# EAGLE design ReelyUsefulPcb-4Blocks (EAGLE 7.4.0)
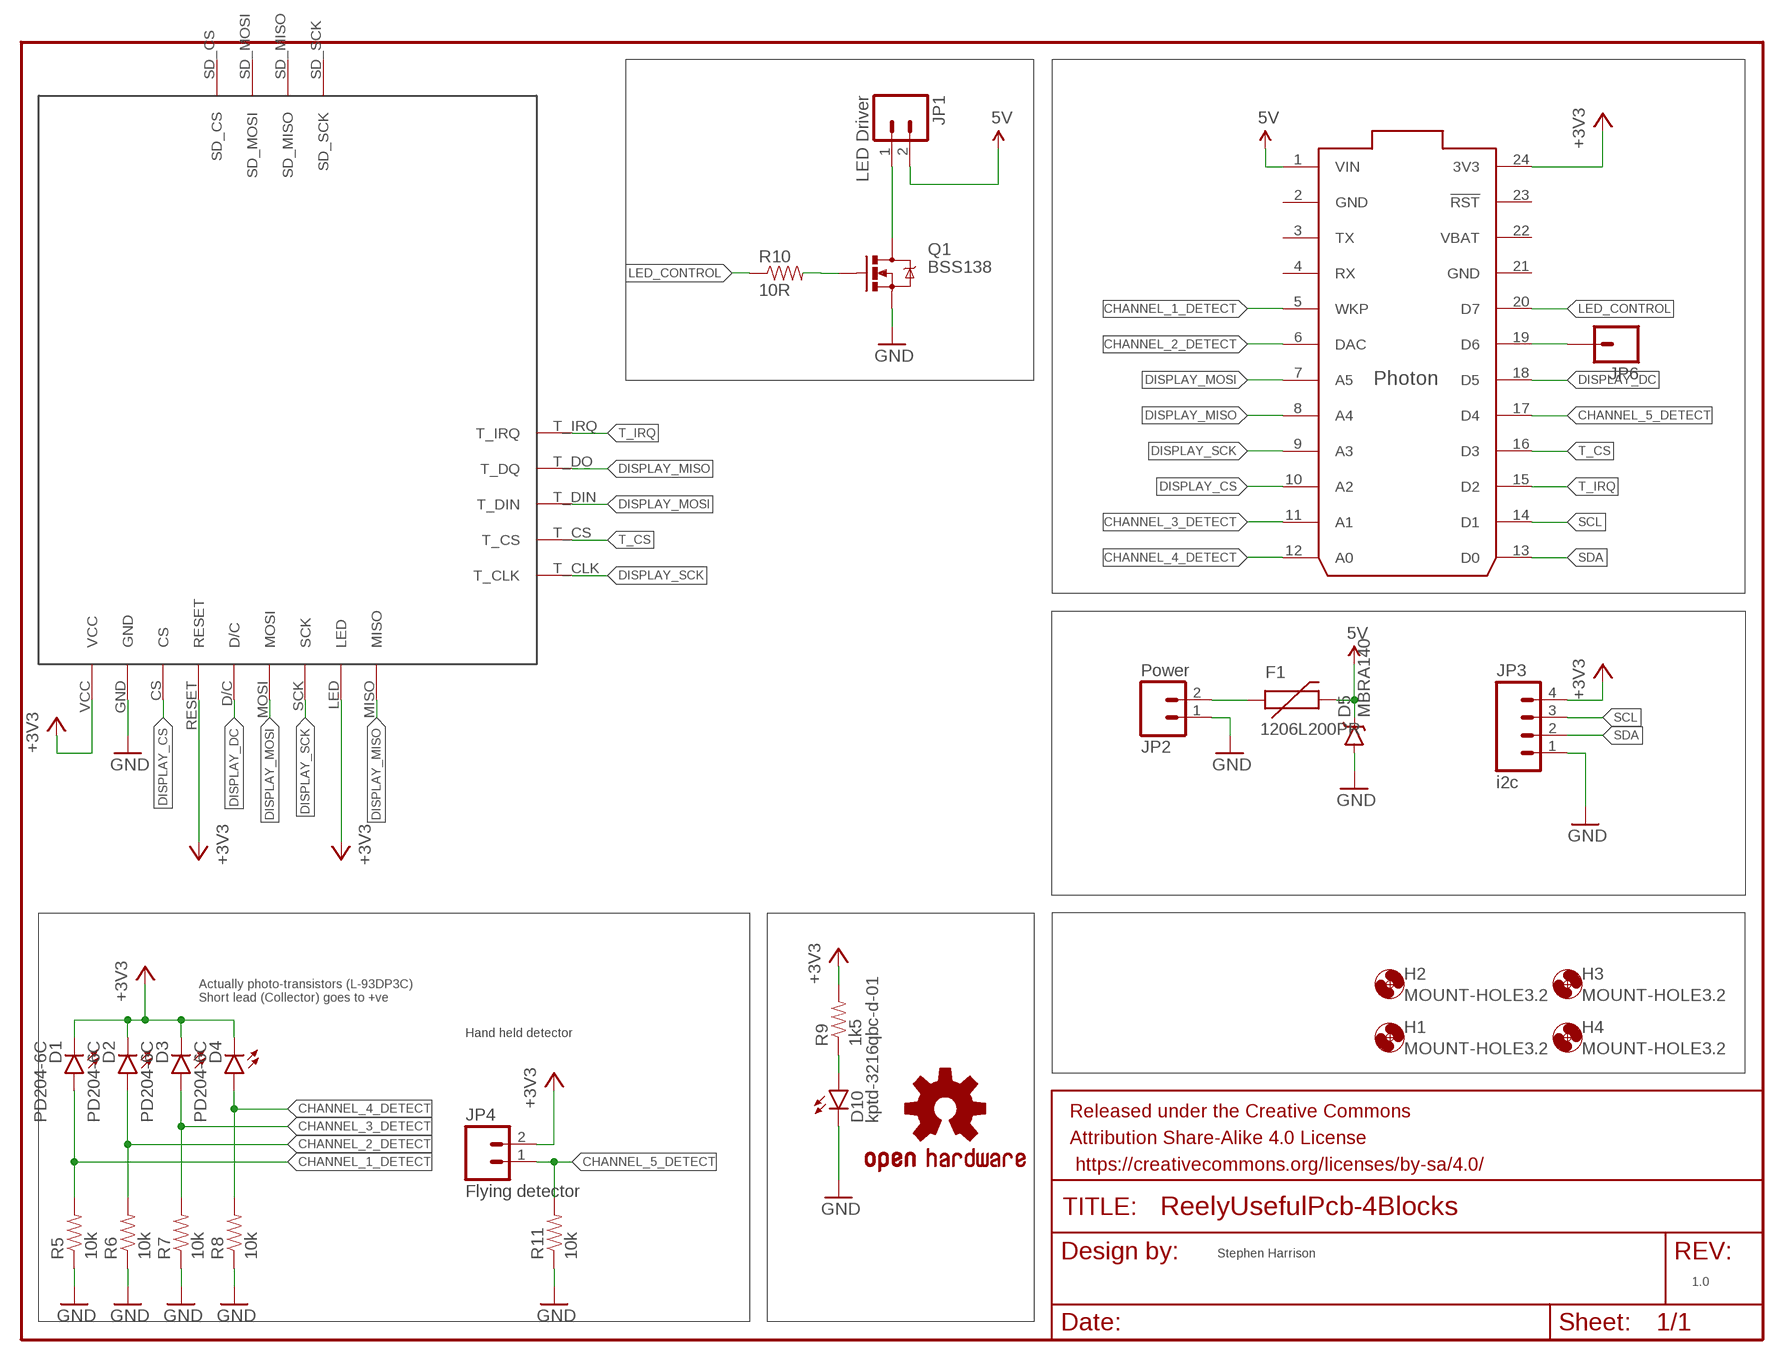
[diagram p0: schematic, sheet 1]

## Parts
D1  PD204-6C  LED3MM  [LED3MM]
D2  PD204-6C  LED3MM  [LED3MM]
D3  PD204-6C  LED3MM  [LED3MM]
D4  PD204-6C  LED3MM  [LED3MM]
D5  MBRA140  [SMA-DIODE]
D10  kptd-3216qbc-d-01  LED1206-BOTTOM  [LED-1206-BOTTOM]
F1  1206L200PR  PTCSMD  [PTC-1206]
FRAME1  FRAME-LETTER  [CREATIVE_COMMONS]
H1  MOUNT-HOLE3.2  [3,2]
H2  MOUNT-HOLE3.2  [3,2]
H3  MOUNT-HOLE3.2  [3,2]
H4  MOUNT-HOLE3.2  [3,2]
JP1  LED Driver  M02JST-PTH-2  [JST-2-PTH]
JP2  Power  M02-JST-2MM-SMT  [JST-2-SMD]
JP3  i2c  M04PTH  [1X04]
JP4  Flying detector  M02JST-PTH-2  [JST-2-PTH]
JP6  M01PTH  [1X01]
LOGO1  OSHW-LOGOL  [OSHW-LOGO-L]
Q1  BSS138  MOSFET-NCHANNELBSS138  [SOT23-3]
R5  10k  RESISTOR1206  [1206]
R6  10k  RESISTOR1206  [1206]
R7  10k  RESISTOR1206  [1206]
R8  10k  RESISTOR1206  [1206]
R9  1k5  RESISTOR1206  [1206]
R10  10R  RESISTOR1206  [1206]
R11  10k  RESISTOR1206  [1206]
U2  TJCTM240  [TJCTM240]
U3  PHOTON_SMD  [PHOTON_SMD]

## Nets
5V: D5.C F1.2 JP1.2 U3.1(VIN)
+3V3: D1.K(C) D2.K(C) D3.K(C) D4.K(C) JP3.4 JP4.2 R9.2 U2.LED U2.RESET U2.VCC U3.24(3V3)
CHANNEL_1_DETECT: D1.A R5.2 U3.5(WKP)
CHANNEL_2_DETECT: D2.A R6.2 U3.6(DAC)
CHANNEL_3_DETECT: D3.A R7.2 U3.11(A1)
CHANNEL_4_DETECT: D4.A R8.2 U3.12(A0)
CHANNEL_5_DETECT: JP4.1 R11.2 U3.17(D4)
DISPLAY_CS: U2.CS U3.10(A2)
DISPLAY_DC: U2.D/C U3.18(D5)
DISPLAY_MISO: U2.MISO U2.T_DO(T_DQ) U3.8(A4)
DISPLAY_MOSI: U2.MOSI U2.T_DIN U3.7(A5)
DISPLAY_SCK: U2.SCK U2.T_CLK U3.9(A3)
GND: D5.A D10.C JP2.1 JP3.1 Q1.2(S) R5.1 R6.1 R7.1 R8.1 R11.1 U2.GND
LED_CONTROL: R10.1 U3.20(D7)
N$1: D10.A R9.1
N$2: JP1.1 Q1.3(D)
N$3: JP6.1 U3.19(D6)
N$5: Q1.1(G) R10.2
N$6: F1.1 JP2.2
SCL: JP3.3 U3.14(D1)
SDA: JP3.2 U3.13(D0)
T_CS: U2.T_CS U3.16(D3)
T_IRQ: U2.T_IRQ U3.15(D2)
Unconnected: U2.SD_CS U2.SD_MISO U2.SD_MOSI U2.SD_SCK U3.3(TX) U3.4(RX) U3.23(!RST) U3.25(EN) U3.26(!SETUP) U3.27(RGB_RED) U3.28(RGB_GREEN) U3.29(RGB_BLUE) U3.30(USB_D-) U3.31(USB_D+)

## Notes on the sheet
- Actually photo-transistors (L-93DP3C)
  Short lead (Collector) goes to +ve
- Hand held detector
- Stephen Harrison
- 1.0

## Power pins joined to a net without a drawn wire
GND: U3.2(GND) U3.21(GND)
VBAT: U3.22(VBAT)

## Library data of the parts
D1-D4 = SparkFun-LED:LED: LEDs Standard schematic elements and footprints for 5mm, 3mm, 1206, and 0603 sized LEDs. 5mm - Spark Fun Electronics SKU : COM-00529 (and others); PROD_ID: DIO-08794
D5 = SparkFun-DiscreteSemi:MBRA140: 40V, 1A Schottky rectifier SMA/DO-214AC package DIO-08053; PROD_ID: DIO-08053
D10 = SparkFun-LED:LED: LEDs Standard schematic elements and footprints for 5mm, 3mm, 1206, and 0603 sized LEDs. 5mm - Spark Fun Electronics SKU : COM-00529 (and others); FARNELL: 2290349
F1 = SparkFun-PowerIC:PTC: Resettable Fuse PTC Resettable Fuse. Spark Fun Electronics SKU : COM-08357; FARNELL: 2383297; PROD_ID: RES-11150
FRAME1 = SparkFun-Aesthetics:FRAME-LETTER: Schematic Frame Standard 8.5x11 US Letter frame
H1-H4 = holes:MOUNT-HOLE: MOUNTING HOLE with drill center marker
JP1 JP4 = SparkFun-Connectors:M02: Standard 2-pin 0.1" header. Use with - straight break away headers ( PRT-00116) - right angle break away headers (PRT-00553) - swiss pins (PRT-00743) - machine pins (PRT-00117) - female headers (PRT-00115) Molex polarized connector foot print use with: PRT-08233 with associated crimp pins and housings. 2.54_SCREWTERM for use with PRT-10571. 3.5mm Screw Terminal footprints for PRT-08084 5mm Screw Terminal footprints for use with PRT-08432; PROD_ID: CONN-09863; SKU: PRT-09914
JP2 = SparkFun-Connectors:M02: Standard 2-pin 0.1" header. Use with - straight break away headers ( PRT-00116) - right angle break away headers (PRT-00553) - swiss pins (PRT-00743) - machine pins (PRT-00117) - female headers (PRT-00115) Molex polarized connector foot print use with: PRT-08233 with associated crimp pins and housings. 2.54_SCREWTERM for use with PRT-10571. 3.5mm Screw Terminal footprints for PRT-08084 5mm Screw Terminal footprints for use with PRT-08432; PROD_ID: CONN-11443
JP3 = SparkFun-Connectors:M04: Header 4 Standard 4-pin 0.1" header. Use with straight break away headers (SKU : PRT-00116), right angle break away headers (PRT-00553), swiss pins (PRT-00743), machine pins (PRT-00117), and female headers (PRT-00115). Molex polarized connector foot print use with SKU : PRT-08231 with associated crimp pins and housings. 1MM SMD Version SKU: PRT-10208
JP6 = SparkFun-Connectors:M01: Header 1 Standard 1-pin 0.1" header. Use with straight break away headers (SKU : PRT-00116), right angle break away headers (PRT-00553), swiss pins (PRT-00743), machine pins (PRT-00117), and female headers (PRT-00115).
LOGO1 = SparkFun-Aesthetics:OSHW-LOGO: Open Source Hardware Logo This logo indicates the piece of hardware it is found on incorporates a OSHW license and/or adheres to the definition of open source hardware found here: http://freedomdefined.org/OSHW
Q1 = SparkFun-DiscreteSemi:MOSFET-NCHANNEL: Common NMOSFET Parts MFG P/N Store ID Prod ID FDD8780 TRANS-09984 SI7820DN TRANS-11055 FDS6630A IC-08089 2N7002PW TRANS-11151 FQP30N06L COM-10213 TRANS-10060 BSS123LT1G TRANS-08345 BSS138 TRANS-00830 BS170 2N7000; FARNELL: 9845330; PROD_ID: TRANS-00830; VALUE: 200mA/50V
R5-R11 = SparkFun-Resistors:RESISTOR: Resistor Basic schematic elements and footprints for 0603, 1206, and PTH resistors.
U2 = 2.8InchTFT:TJCTM240: 2.8 tft spi 240*320 V1.1
U3 = Particle:PHOTON_SMD: Photon (without headers) - designed to be surface mounted with 7 extra exposed pads on the bottom of the board which include, 3 RGB LED outputs, /SETUP, EN (3.3V SMPS enable input), USB D+ and USB D-.

## Board
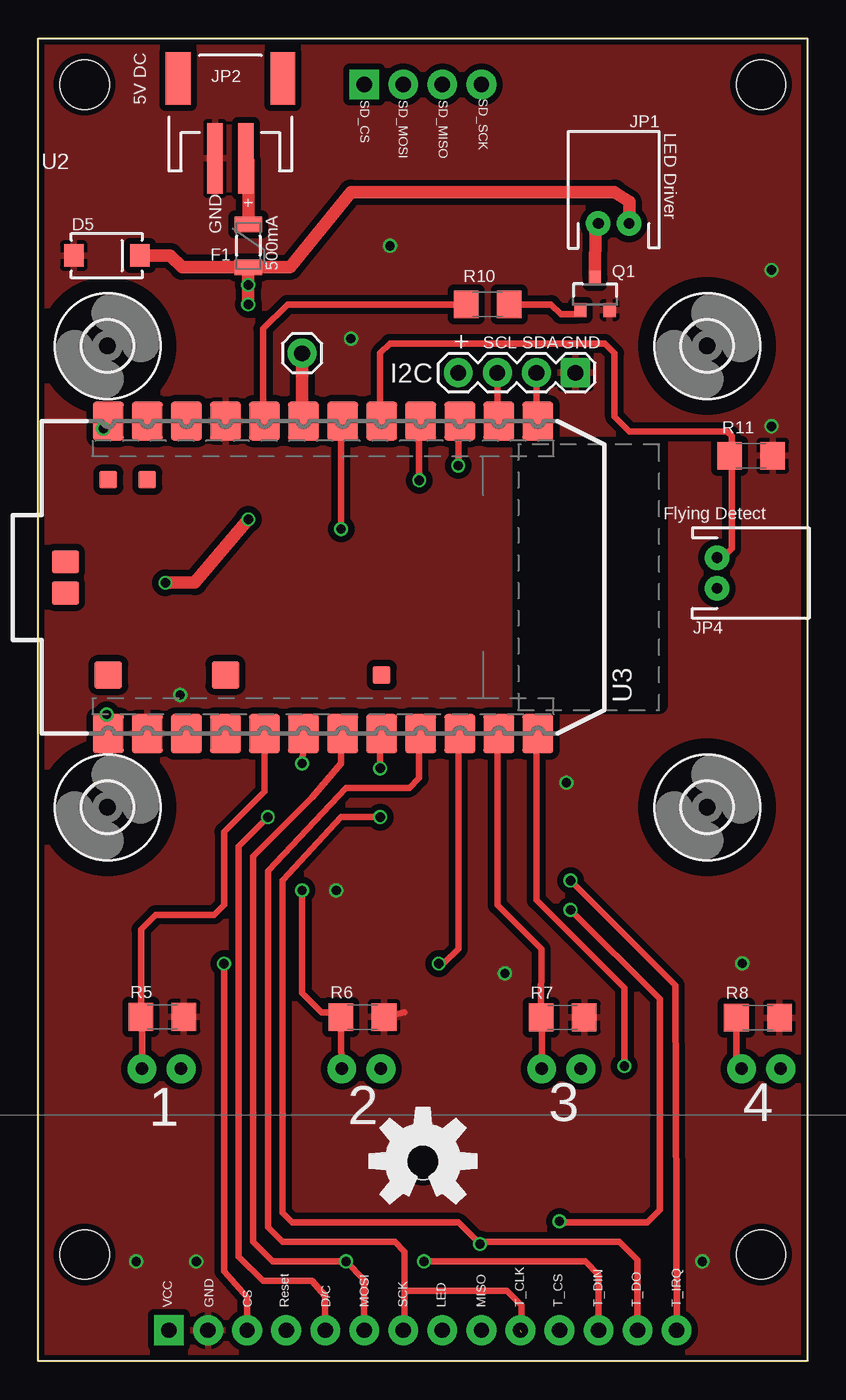
[diagram p1: board, top side]
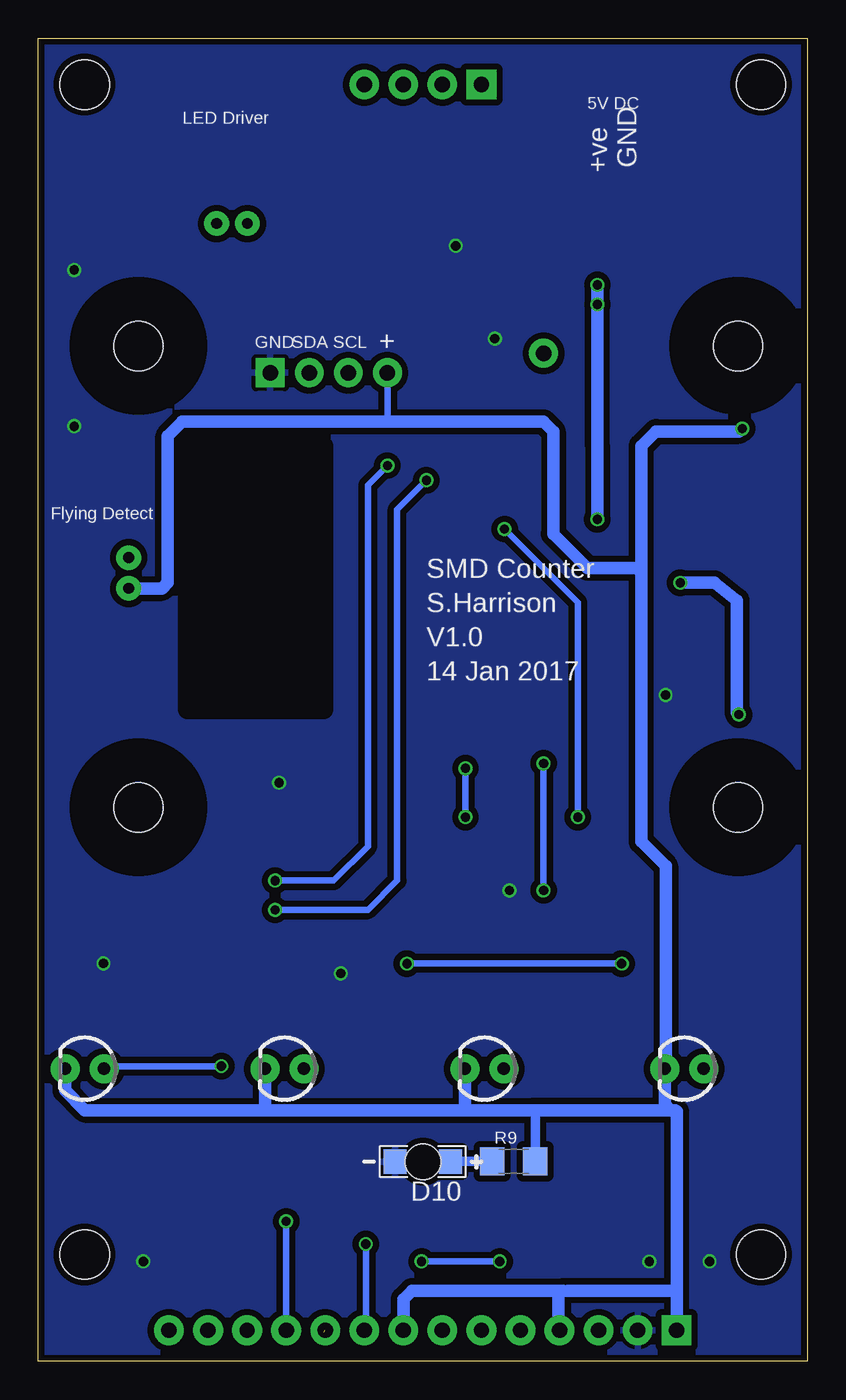
[diagram p2: board, bottom side, seen from below]

Size 50 x 86 mm. Coordinates in mm from the lower left corner, seen from the top.
Outline: 0,0 50,0 50,86 0,86 0,0
Copper layers (1*16): Top 0.035mm / dielectric 1.5mm / Bottom 0.035mm
Design rules "dirt_cheap_dirty_boards.v1": minimum track width 5mil, minimum drill 12mil, track to track 5mil, track to pad 5mil, pad to pad 5mil, via to via 5mil, smd to smd 0mil, copper to edge 10mil, drill to drill 10mil, minimum pad ring 10mil, minimum via ring 6mil, stop-mask expansion 2mil, vias tented up to drill 25mil, thermal gap 10mil
tRestrict: area 31.4,42.7 to 40.3,59.5
bRestrict: area 31.4,42.4 to 40.3,59.5

### Footprints (pad centres in the part's own frame; a part is rotated, then mirrored left to right if it is on the bottom)
LED3MM = drill 0.813 pad 1.88: A -1.27,0; K 1.27,0
SMA-DIODE = smd 1.27 x 1.47: A -2.15,0; C 2.15,0
LED-1206-BOTTOM = smd 1.5 x 1.6: A -1.8,0; C 1.8,0 | hole 2.3: 0,0
PTC-1206 = smd 1 x 1.8: 1 -1.4,0; 2 1.4,0
3,2 = hole 3.2: 0,0
JST-2-PTH = drill 0.7 pad 1.6: 1 -1,0; 2 1,0
JST-2-SMD = smd 1 x 4.6: 1 -1,-3.7; 2 1,-3.7 | smd 1.6 x 3.4: NC1 -3.4,1.5; NC2 3.4,1.5
1X04 = drill 1.016 pad 1.88 square: 1 0,0 | drill 1.016 pad 1.88: 2 2.54,0; 3 5.08,0; 4 7.62,0
1X01 = drill 1.016 pad 1.88: 1 0,0
SOT23-3 = smd 0.8 x 0.9: 1 -0.95,-1; 2 0.95,-1; 3 0,1.1
1206 = smd 1.6 x 1.8: 1 -1.4,0; 2 1.4,0
TJCTM240 = drill 1 pad 1.93: CS 13.57,2; D/C 18.65,2; GND 11.03,2; LED 26.27,2; MISO 28.81,2; MOSI 21.19,2; RESET 16.11,2; SCK 23.73,2; SD_MISO 26.27,83; SD_MOSI 23.73,83; SD_SCK 28.81,83; T_CLK 31.35,2; T_CS 33.89,2; T_DIN 36.43,2; T_DO 38.97,2; T_IRQ 41.51,2 | drill 1 pad 1.93 square: SD_CS 21.19,83; VCC 8.49,2 | hole 3.2: 3,6.92; 47,6.92; 3,83; 47,83
PHOTON_SMD = smd 2.54 x 2.032: 1 0,32.258; 2 0,29.718; 3 0,27.178; 4 0,24.638; 5 0,22.098; 6 0,19.558; 7 0,17.018; 8 0,14.478; 9 0,11.938; 10 0,9.398; 11 0,6.858; 12 0,4.318; 13 20.32,4.318; 14 20.32,6.858; 15 20.32,9.398; 16 20.32,11.938; 17 20.32,14.478; 18 20.32,17.018; 19 20.32,19.558; 20 20.32,22.098; 21 20.32,24.638; 22 20.32,27.178; 23 20.32,29.718; 24 20.32,32.258 | smd 1.778 x 1.778: 25 3.81,32.258; 26 3.81,24.638 | smd 1.143 x 1.143: 27 3.81,14.478; 28 16.51,29.718; 29 16.51,32.258 | smd 1.524 x 1.778: 30 11.176,35.052; 31 9.144,35.052

### Placement (x,y rotation side)
D1  8,19 180 bottom
D2  21,19 180 bottom
D3  34,19 180 bottom
D4  47,19 180 bottom
D5  4.45,71.88 0 top
D10  25,12.97 180 bottom
F1  13.65,72.52 270 top
FRAME1  2.2,-42.3 0 top  (outside the outline)
H1  43.5,36 0 top
H2  4.5,36 0 top
H3  4.5,66 0 top
H4  43.5,66 0 top
JP1  37.41,73.97 0 top
JP2  12.48,81.9 0 top
JP3  34.92,64.26 180 top
JP4  44.13,51.24 270 top
JP6  17.14,65.53 0 top
LOGO1  25,13 0 top
Q1  36.2,69.34 0 top
R5  8.06,22.38 180 top
R6  21.07,22.37 180 top
R7  34.09,22.35 180 top
R8  46.79,22.33 180 top
R9  19.09,12.99 0 bottom
R10  29.21,68.7 0 top
R11  46.35,58.86 180 top
U2  0,0 0 top
U3  36.8,40.8 90 top

### Tracks (layer width: path | path; a pad name or v marks a point on that pad's centre or on a via)
5V  (via drill 0.6)
  Top 0.813: v13.65,54.73 10.16,50.61 v8.26,50.61 | F1.2 9.34,71.12 8.57,71.88 D5.C | F1.2 16.38,71.12 20.32,76.01 37.47,76.01 38.42,75.37 JP1.2 | F1.2 v13.65,69.97 v13.65,68.7 | v4.45,42.03 4.45,40.9 U3.1
  Top 1.016: JP1.2
  Bottom 0.813: v13.65,54.73 13.65,59.59 v13.65,69.97 | v8.26,50.61 6.03,50.61 4.57,49.47 4.57,42.16 v4.45,42.03
+3V3  (via drill 0.6)
  Top 0.813: 4.76,61.09 4.54,60.99 v4.22,60.64 4.76,60.9 4.76,61.09 | 4.76,61.09 4.51,61.09 U3.24
  Bottom 0.406: JP3.4 27.3,61.09
  Bottom 0.61: R9.2 17.69,16.23 17.78,16.32
  Bottom 0.813: 10.79,51.24 10.79,33.78 9.21,32.19 9.21,19.06 D1.K 9.27,16.7 8.89,16.32 | 10.79,51.24 10.79,59.5 9.84,60.45 4.45,60.45 v4.22,60.64 | 8.89,16.32 8.57,16.32 8.49,16.23 8.49,4.57 | 8.89,16.32 17.78,16.32 22.23,16.32 | 35.56,16.32 46.99,16.32 48.26,17.59 D4.K | 35.56,16.32 22.23,16.32 | JP4.2 41.96,50.24 41.59,50.61 41.59,60.13 40.64,61.09 27.3,61.09 17.14,61.09 16.51,60.45 16.51,53.78 14.29,51.56 11.11,51.56 10.79,51.24 | 8.49,4.57 U2.VCC 8.49,3.54 | D2.K 22.27,16.36 22.23,16.32 | D3.K 35.27,16.61 35.56,16.32 | 8.49,4.57 15.56,4.57 16.22,4.51 | 16.22,4.51 16.19,3.94 16.19,2.08 U2.RESET | U2.LED 26.27,4.02 25.72,4.57 15.88,4.57 16.22,4.51
CHANNEL_1_DETECT
  Top 0.406: U3.5 14.7,37.05 12.06,34.41 12.06,29.65 11.43,29.02 7.62,29.02 6.67,28.06 6.67,22.71 R5.2 | R5.2 6.73,22.25 D1.A 6.73,20.19 | 6.64,22.35 R5.2
CHANNEL_2_DETECT  (via drill 0.6)
  Top 0.406: U3.6 17.24,39.91 v17.14,38.86 | v17.14,30.61 17.14,23.94 18.41,22.67 19.34,22.67 R6.2 | 19.37,22.98 R6.2 | D2.A 19.73,19.77 19.68,20.13 19.68,22.67 R6.2
  Bottom 0.406: v17.14,38.86 v17.14,30.61
CHANNEL_3_DETECT
  Top 0.406: U3.11 29.84,40.7 29.84,29.65 32.71,26.79 R7.2 32.73,22.31 D3.A
CHANNEL_4_DETECT  (via drill 0.6)
  Top 0.406: v38.1,19.18 38.1,24.26 32.38,29.97 32.38,40.7 U3.12 | R8.2 45.39,19.34 D4.A
  Bottom 0.406: v38.1,19.18 45.04,19.18 45.39,19.14 45.39,19.34 D4.A
CHANNEL_5_DETECT
  Top 0.406: U3.17 22.23,61.22 22.23,65.53 22.86,66.16 36.83,66.16 37.47,65.53 37.47,61.4 38.42,60.45 44.77,60.45 45.09,60.13 45.09,58.99 R11.2 45.09,58.73 45.09,52.83 44.5,52.24 JP4.1
DISPLAY_CS  (via drill 0.6)
  Top 0.406: U2.CS 13.57,4.13 12.06,5.84 v12.06,25.84 | 27.3,40.9 U3.10 27.3,40.7 27.3,26.8 26.35,25.84 v26.04,25.84
  Bottom 0.406: v12.06,25.84 v26.04,25.84
DISPLAY_DC  (via drill 0.6)
  Top 0.406: U2.D/C 18.65,4.23 17.78,5.21 14.61,5.21 13.02,6.79 13.02,33.46 v14.92,35.37 | v19.68,54.1 19.68,61.02 U3.18
  Bottom 0.406: v14.92,35.37 14.92,49.34 v19.68,54.1
DISPLAY_MISO  (via drill 0.6)
  Top 0.406: U3.8 22.23,40.7 v22.23,38.54 | U2.T_DO 38.95,2.02 38.95,6.57 37.78,7.74 28.84,7.74 v28.71,7.61 27.3,9.02 16.51,9.02 15.88,9.65 15.88,31.24 19.68,35.37 v22.23,35.37
  Bottom 0.406: v22.23,35.37 v22.23,38.54 | v28.71,7.61 28.71,2.1 U2.MISO
DISPLAY_MOSI  (via drill 0.6)
  Top 0.406: U2.MOSI 21.19,5.29 v20,6.47 15.24,6.47 13.97,7.74 13.97,32.83 17.78,36.64 19.68,38.86 19.68,40.7 U3.7 | U2.T_DIN 36.43,5.61 35.56,6.47 v25.08,6.47
  Bottom 0.406: v25.08,6.47 v20,6.47
DISPLAY_SCK  (1 unrouted)
  Top 0.406: U3.9 24.77,40.7 24.77,37.91 24.13,37.27 20,37.27 14.92,31.88 14.92,8.7 15.88,7.74 23.18,7.74 23.81,7.11 23.81,4.57 | 31.41,1.87 31.41,3.63 30.48,4.57 23.81,4.57 | 23.81,4.57 23.81,2.08 U2.SCK
GND  (via drill 0.6)
  Top 0.406: R6.1 23.8,22.68
  other vias: 9.21,43.3 30.34,25.2 45.77,25.86 10.27,6.47 34.34,37.61 47.68,70.94 47.68,60.78 19.37,30.61 22.86,72.52 20.32,66.48 6.35,6.47 43.18,6.47
  pour Bottom (isolate 0.406): -2.86,87.44 49.85,87.44 50.15,-2.59 -2.56,-2.59
  pour Top (isolate 0.406, rank 5): -2.22,87.44 49.95,87.14 50.05,-1.57 -2.44,-1.27 -2.54,87.44
LED_CONTROL
  Top 0.406: R10.1 16.19,68.7 14.61,67.12 14.61,61.22 U3.20
N$1
  Bottom 0.61: R9.1 23.18,12.99 D10.A
N$2
  Top 0.813: Q1.3 36.23,73.78 JP1.1
N$3
  Top 0.813: JP6.1 17.14,61.22 U3.19
N$5
  Top 0.406: R10.2 33.34,68.7 33.97,68.07 34.98,68.07 Q1.1
N$6
  Top 0.813: F1.1 13.65,78.03 JP2.2
SCL
  Top 0.406: JP3.3 29.84,61.22 U3.14
SDA
  Top 0.406: JP3.2 32.38,61.22 U3.13
T_CS  (via drill 0.6)
  Top 0.305: 40.32,9.65 40.27,9.7
  Top 0.406: v33.89,9.09 33.83,9.03 39.6,9.03 40.27,9.7 40.4,9.83 40.4,23.54 v34.61,29.34 | v24.77,57.27 24.77,61.02 U3.16
  Bottom 0.406: v34.61,29.34 28.57,29.34 26.67,31.24 26.67,55.37 v24.77,57.27 | U2.T_CS v33.89,9.09
T_IRQ  (via drill 0.6)
  Top 0.406: U2.T_IRQ 41.41,24.44 v34.61,31.24 | v27.3,58.23 27.3,61.02 U3.15
  Bottom 0.406: v34.61,31.24 30.8,31.24 28.57,33.46 28.57,56.96 v27.3,58.23

### Text on the board
tNames: 5V DC | + | GND | 500mA | + | SCL | SDA | GND | I2C | Flying Detect | 3 | 4 | 1 | 2
bNames: 5V DC | LED Driver | GND | +ve | + | SCL | SDA | GND | Flying Detect | SMD Counter | S.Harrison | V1.0 | 14 Jan 2017
Measures: < Actual dispencer back edge | < Actual dispenser right hand edge
tDocu: Current block start | 1mm Gap between disppencer block and PCB